# Altium project LibreSolar_BMS48V.PrjPcb
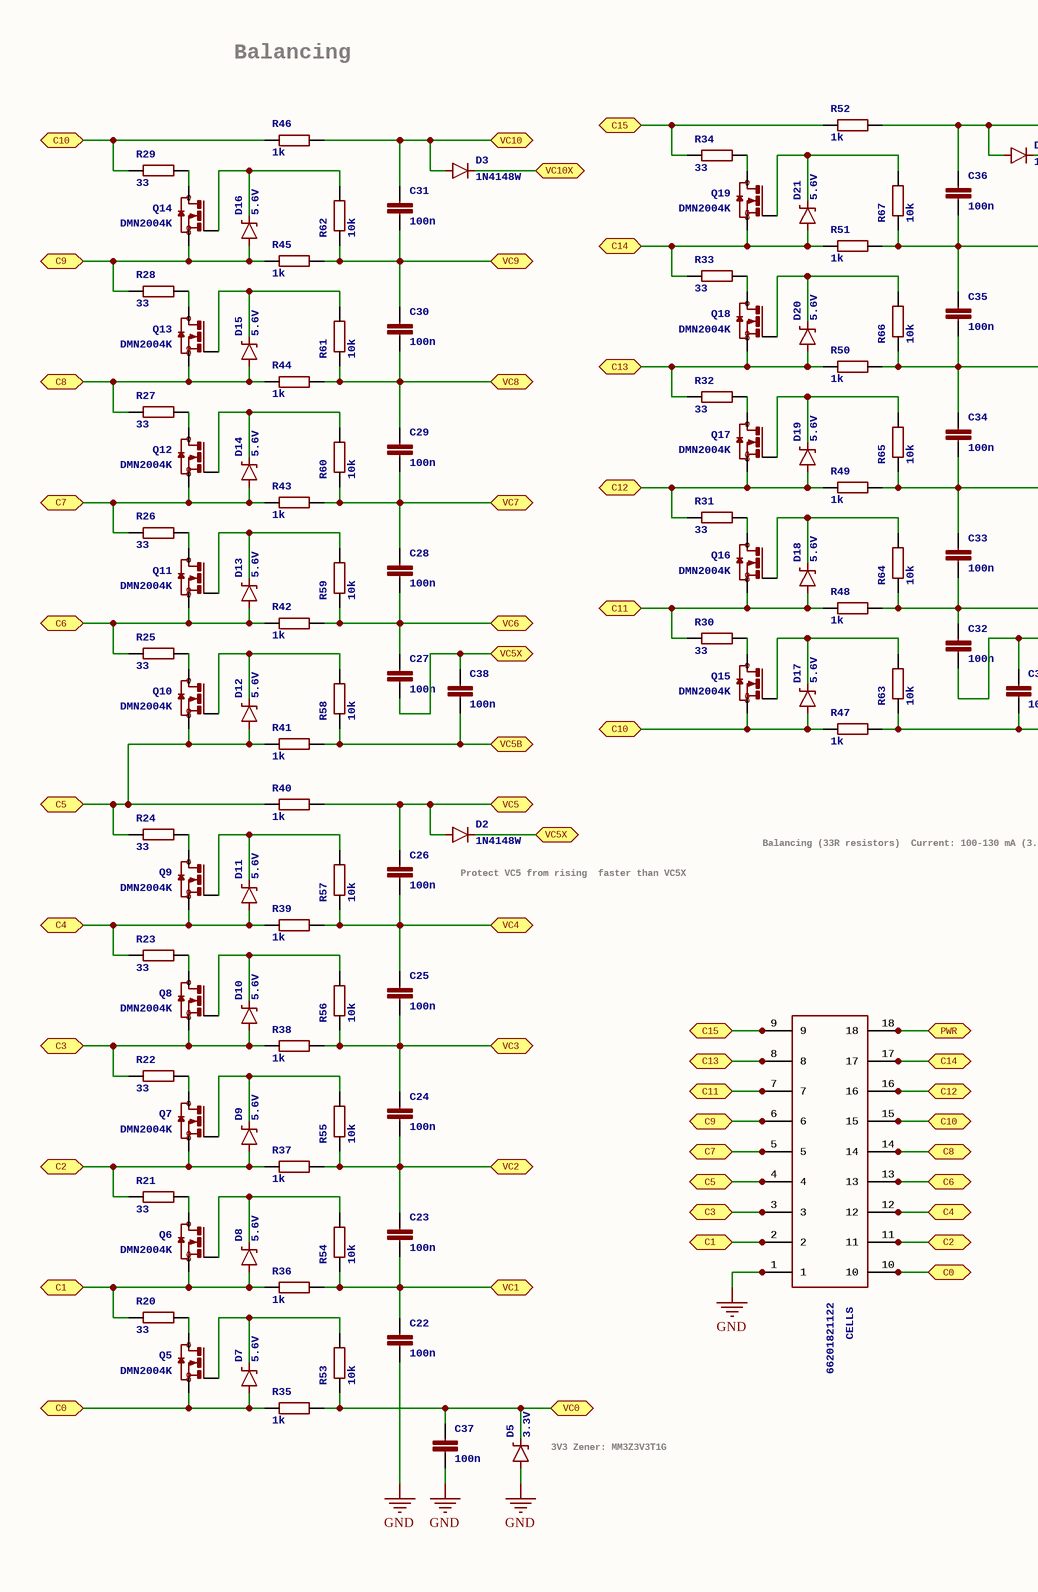
[diagram p0: LibreSolar_BMS48V_0.SchDoc, left]
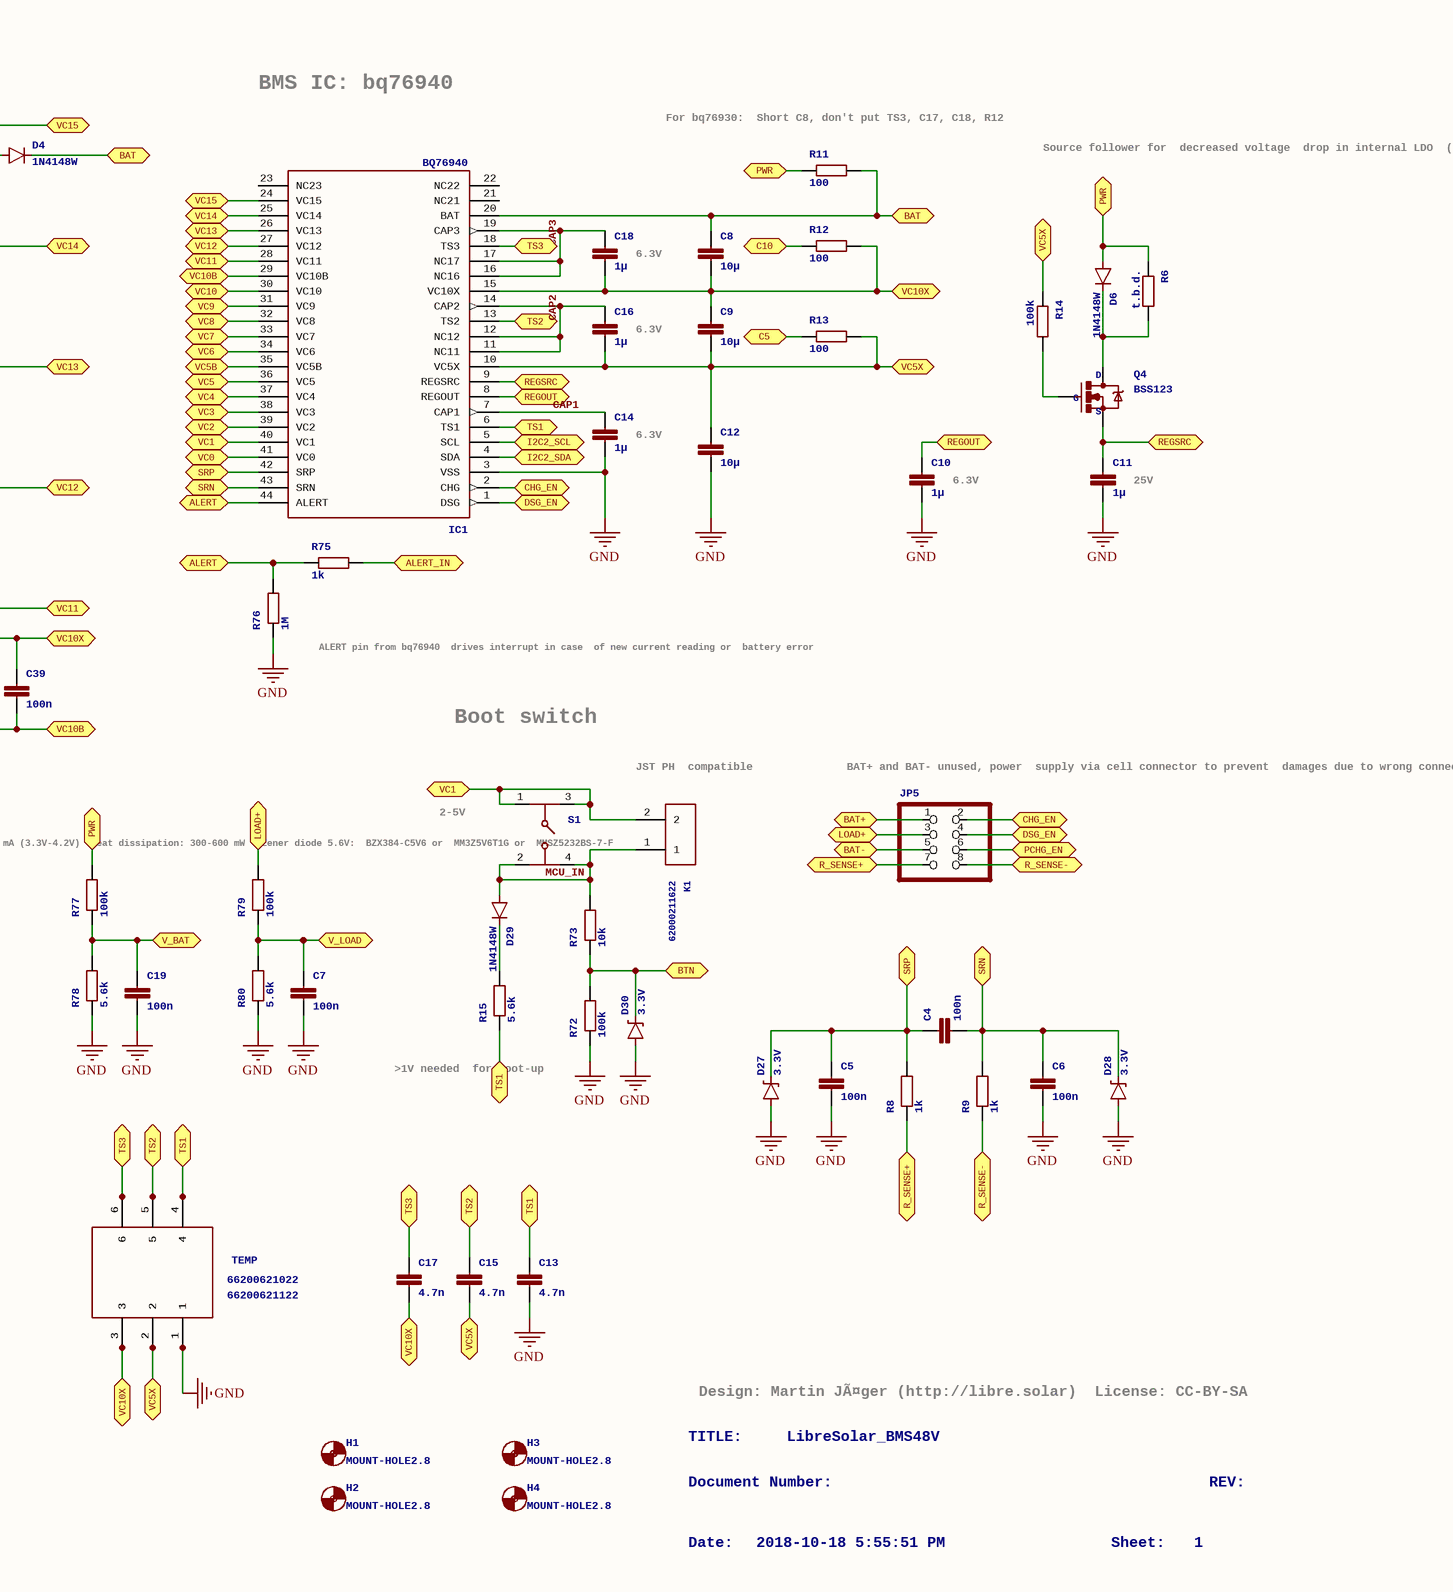
[diagram p1: LibreSolar_BMS48V_0.SchDoc, right]
2 sheets, 201 parts. Net scope: flat (ports and power ports of the same name join across sheets).
Board file: LibreSolar_BMS48V.PcbDoc
Sheets:
  LibreSolar_BMS48V_0.SchDoc
  LibreSolar_BMS48V_1.SchDoc

## Sheet LibreSolar_BMS48V_0.SchDoc: LibreSolar_BMS48V
size 410 x 286 mm; Date: 2018-10-18 5:55:51 PM; SheetNumber: 1; GateName_1: G$1; SymbolName_1: DINA3_L; LibraryName: frames; DeviceSetName: DINA3_L; GateName_2: G$2; SymbolName_2: DOCFIELD

### Parts
C4  100n  [C0603]
C5  100n  [C0603]
C6  100n  [C0603]
C7  100n  [C0603]
C8  10µ  [C1210]
C9  10µ  [C1210]
C10  1µ  [C0603]
C11  1µ  [C0603]
C12  10µ  [C1210]
C13  4.7n  [C0603]
C14  1µ  [C0603]
C15  4.7n  [C0603]
C16  1µ  [C0603]
C17  4.7n  [C0603]
C18  1µ  [C0603]
C19  100n  [C0603]
C22  100n  [C0603]
C23  100n  [C0603]
C24  100n  [C0603]
C25  100n  [C0603]
C26  100n  [C0603]
C27  100n  [C0603]
C28  100n  [C0603]
C29  100n  [C0603]
C30  100n  [C0603]
C31  100n  [C0603]
C32  100n  [C0603]
C33  100n  [C0603]
C34  100n  [C0603]
C35  100n  [C0603]
C36  100n  [C0603]
C37  100n  [C0603]
C38  100n  [C0603]
C39  100n  [C0603]
CELLS  66201821022  [66201821022]  (value not drawn)
D2  1N4148W  [SOD-123]
D3  1N4148W  [SOD-123]
D4  1N4148W  [SOD-123]
D5  3.3V  [SOD-323]
D6  1N4148W  [SOD-123]
D7  5.6V  [SOD-323]
D8  5.6V  [SOD-323]
D9  5.6V  [SOD-323]
D10  5.6V  [SOD-323]
D11  5.6V  [SOD-323]
D12  5.6V  [SOD-323]
D13  5.6V  [SOD-323]
D14  5.6V  [SOD-323]
D15  5.6V  [SOD-323]
D16  5.6V  [SOD-323]
D17  5.6V  [SOD-323]
D18  5.6V  [SOD-323]
D19  5.6V  [SOD-323]
D20  5.6V  [SOD-323]
D21  5.6V  [SOD-323]
D27  3.3V  [SOD-323]
D28  3.3V  [SOD-323]
D29  1N4148W  [SOD-123]
D30  3.3V  [SOD-323]
H1  MOUNT-HOLE2.8  [2,8]
H2  MOUNT-HOLE2.8  [2,8]
H3  MOUNT-HOLE2.8  [2,8]
H4  MOUNT-HOLE2.8  [2,8]
IC1  BQ76940  [TSSOP44]
JP5  PINHD-2X4  [2X04]  (value not drawn)
K1  62000211622  [62000211622]
K4  66200621122  [66200621122]
K5  66201821122  [66201821122]
Q4  BSS123  [SOT23-3]
Q5  DMN2004K  [SOT23]
Q6  DMN2004K  [SOT23]
Q7  DMN2004K  [SOT23]
Q8  DMN2004K  [SOT23]
Q9  DMN2004K  [SOT23]
Q10  DMN2004K  [SOT23]
Q11  DMN2004K  [SOT23]
Q12  DMN2004K  [SOT23]
Q13  DMN2004K  [SOT23]
Q14  DMN2004K  [SOT23]
Q15  DMN2004K  [SOT23]
Q16  DMN2004K  [SOT23]
Q17  DMN2004K  [SOT23]
Q18  DMN2004K  [SOT23]
Q19  DMN2004K  [SOT23]
R6  t.b.d.  [R0603]
R8  1k  [R0603]
R9  1k  [R0603]
R11  100  [R0603]
R12  100  [R0603]
R13  100  [R0603]
R14  100k  [R0603]
R15  5.6k  [R0603]
R20  33  [R2010]
R21  33  [R2010]
R22  33  [R2010]
R23  33  [R2010]
R24  33  [R2010]
R25  33  [R2010]
R26  33  [R2010]
R27  33  [R2010]
R28  33  [R2010]
R29  33  [R2010]
R30  33  [R2010]
R31  33  [R2010]
R32  33  [R2010]
R33  33  [R2010]
R34  33  [R2010]
R35  1k  [R0603]
R36  1k  [R0603]
R37  1k  [R0603]
R38  1k  [R0603]
R39  1k  [R0603]
R40  1k  [R0603]
R41  1k  [R0603]
R42  1k  [R0603]
R43  1k  [R0603]
R44  1k  [R0603]
R45  1k  [R0603]
R46  1k  [R0603]
R47  1k  [R0603]
R48  1k  [R0603]
R49  1k  [R0603]
R50  1k  [R0603]
R51  1k  [R0603]
R52  1k  [R0603]
R53  10k  [R0603]
R54  10k  [R0603]
R55  10k  [R0603]
R56  10k  [R0603]
R57  10k  [R0603]
R58  10k  [R0603]
R59  10k  [R0603]
R60  10k  [R0603]
R61  10k  [R0603]
R62  10k  [R0603]
R63  10k  [R0603]
R64  10k  [R0603]
R65  10k  [R0603]
R66  10k  [R0603]
R67  10k  [R0603]
R72  100k  [R0603]
R73  10k  [R0603]
R75  1k  [R0603]
R76  1M  [R0603]
R77  100k  [R0603]
R78  5.6k  [R0603]
R79  100k  [R0603]
R80  5.6k  [R0603]
S1  430182050816  [430182050816]  (value not drawn)
TEMP  66200621022  [66200621022]

### Ports
ALERT, ALERT_IN, BAT, BAT+, BAT-, BTN, C0, C1, C2, C3, C4, C5, C6, C7, C8, C9, C10, C11, C12, C13, C14, C15, CHG_EN, DSG_EN, I2C2_SCL, I2C2_SDA, LOAD+, PCHG_EN, PWR, R_SENSE+, R_SENSE-, REGOUT, REGSRC, SRN, SRP, TS1, TS2, TS3, V_BAT, V_LOAD, VC0, VC1, VC2, VC3, VC4, VC5, VC5B, VC5X, VC6, VC7, VC8, VC9, VC10, VC10B, VC10X, VC11, VC12, VC13, VC14, VC15

### Nets
GND: C5.2 C6.2 C7.2 C10.2 C11.2 C12.2 C13.2 C14.2 C19.2 C22.2 C37.2 CELLS.1 D5.A D27.A D28.A D30.A IC1.3(VSS) K4.1 K5.1 R72.1 R76.1 R78.1 R80.1 TEMP.1
CAP1: C14.1 IC1.7(CAP1)
CAP2: C16.1 IC1.11(NC11) IC1.12(NC12) IC1.14(CAP2)
CAP3: C18.1 IC1.16(NC16) IC1.17(NC17) IC1.19(CAP3)
MCU_IN: D29.A K1.1 R73.2 S1.2 S1.4
NetC3_1: CELLS.18 D6.A K5.18 R6.1 R11.1 R77.2 ; port PWR
NetC4_1: C4.1 C5.1 D27.C IC1.42(SRP) R8.2 ; port SRP
NetC4_2: C4.2 C6.1 D28.C IC1.43(SRN) R9.2 ; port SRN
NetC7_1: C7.1 R79.1 R80.2 ; port V_LOAD
NetC8_1: C8.1 D4.C IC1.20(BAT) R11.2 ; port BAT
NetC8_2: C8.2 C9.1 C17.2 C18.2 C32.2 C39.1 D3.C IC1.15(VC10X) K4.3 R12.2 TEMP.3 ; port VC10X
NetC9_2: C9.2 C12.1 C15.2 C16.2 C27.2 C38.1 D2.C IC1.10(VC5X) K4.2 R13.2 R14.1 TEMP.2 ; port VC5X
NetC10_1: C10.1 IC1.8(REGOUT) ; port REGOUT
NetC11_1: C11.1 IC1.9(REGSRC) Q4.2(S) ; port REGSRC
NetC13_1: C13.1 IC1.6(TS1) K4.4 R15.1 TEMP.4 ; port TS1
NetC15_1: C15.1 IC1.13(TS2) K4.5 TEMP.5 ; port TS2
NetC17_1: C17.1 IC1.18(TS3) K4.6 TEMP.6 ; port TS3
NetC19_1: C19.1 R77.1 R78.2 ; port V_BAT
NetC22_1: C22.1 C23.2 IC1.40(VC1) K1.2 R36.2 R54.1 S1.1 S1.3 ; port VC1
NetC23_1: C23.1 C24.2 IC1.39(VC2) R37.2 R55.1 ; port VC2
NetC24_1: C24.1 C25.2 IC1.38(VC3) R38.2 R56.1 ; port VC3
NetC25_1: C25.1 C26.2 IC1.37(VC4) R39.2 R57.1 ; port VC4
NetC26_1: C26.1 D2.A IC1.36(VC5) R40.2 ; port VC5
NetC27_1: C27.1 C28.2 IC1.34(VC6) R42.2 R59.1 ; port VC6
NetC28_1: C28.1 C29.2 IC1.33(VC7) R43.2 R60.1 ; port VC7
NetC29_1: C29.1 C30.2 IC1.32(VC8) R44.2 R61.1 ; port VC8
NetC30_1: C30.1 C31.2 IC1.31(VC9) R45.2 R62.1 ; port VC9
NetC31_1: C31.1 D3.A IC1.30(VC10) R46.2 ; port VC10
NetC32_1: C32.1 C33.2 IC1.28(VC11) R48.2 R64.1 ; port VC11
NetC33_1: C33.1 C34.2 IC1.27(VC12) R49.2 R65.1 ; port VC12
NetC34_1: C34.1 C35.2 IC1.26(VC13) R50.2 R66.1 ; port VC13
NetC35_1: C35.1 C36.2 IC1.25(VC14) R51.2 R67.1 ; port VC14
NetC36_1: C36.1 D4.A IC1.24(VC15) R52.2 ; port VC15
NetC37_1: C37.1 D5.C IC1.41(VC0) R35.2 R53.1 ; port VC0
NetC38_2: C38.2 IC1.35(VC5B) R41.2 R58.1 ; port VC5B
NetC39_2: C39.2 IC1.29(VC10B) R47.2 R63.1 ; port VC10B
NetCELLS_2: CELLS.2 D8.A K5.2 Q6.2(S) R20.1 R36.1 ; port C1
NetCELLS_3: CELLS.3 D10.A K5.3 Q8.2(S) R22.1 R38.1 ; port C3
NetCELLS_4: CELLS.4 D12.A K5.4 Q10.2(S) R13.1 R24.1 R40.1 R41.1 ; port C5
NetCELLS_5: CELLS.5 D14.A K5.5 Q12.2(S) R26.1 R43.1 ; port C7
NetCELLS_6: CELLS.6 D16.A K5.6 Q14.2(S) R28.1 R45.1 ; port C9
NetCELLS_7: CELLS.7 D18.A K5.7 Q16.2(S) R30.1 R48.1 ; port C11
NetCELLS_8: CELLS.8 D20.A K5.8 Q18.2(S) R32.1 R50.1 ; port C13
NetCELLS_9: CELLS.9 K5.9 R34.1 R52.1 ; port C15
NetCELLS_10: CELLS.10 D7.A K5.10 Q5.2(S) R35.1 ; port C0
NetCELLS_11: CELLS.11 D9.A K5.11 Q7.2(S) R21.1 R37.1 ; port C2
NetCELLS_12: CELLS.12 D11.A K5.12 Q9.2(S) R23.1 R39.1 ; port C4
NetCELLS_13: CELLS.13 D13.A K5.13 Q11.2(S) R25.1 R42.1 ; port C6
NetCELLS_14: CELLS.14 D15.A K5.14 Q13.2(S) R27.1 R44.1 ; port C8
NetCELLS_15: CELLS.15 D17.A K5.15 Q15.2(S) R12.1 R29.1 R46.1 R47.1 ; port C10
NetCELLS_16: CELLS.16 D19.A K5.16 Q17.2(S) R31.1 R49.1 ; port C12
NetCELLS_17: CELLS.17 D21.A K5.17 Q19.2(S) R33.1 R51.1 ; port C14
NetD6_C: D6.C Q4.3(D) R6.2
NetD7_C: D7.C Q5.1(G) R53.2
NetD8_C: D8.C Q6.1(G) R54.2
NetD9_C: D9.C Q7.1(G) R55.2
NetD10_C: D10.C Q8.1(G) R56.2
NetD11_C: D11.C Q9.1(G) R57.2
NetD12_C: D12.C Q10.1(G) R58.2
NetD13_C: D13.C Q11.1(G) R59.2
NetD14_C: D14.C Q12.1(G) R60.2
NetD15_C: D15.C Q13.1(G) R61.2
NetD16_C: D16.C Q14.1(G) R62.2
NetD17_C: D17.C Q15.1(G) R63.2
NetD18_C: D18.C Q16.1(G) R64.2
NetD19_C: D19.C Q17.1(G) R65.2
NetD20_C: D20.C Q18.1(G) R66.2
NetD21_C: D21.C Q19.1(G) R67.2
NetD29_C: D29.C R15.2
NetD30_C: D30.C R72.2 R73.1 ; port BTN
NetIC1_1: IC1.1(DSG) JP5.4 ; port DSG_EN
NetIC1_2: IC1.2(CHG) JP5.2 ; port CHG_EN
NetIC1_4: IC1.4(SDA) ; port I2C2_SDA
NetIC1_5: IC1.5(SCL) ; port I2C2_SCL
NetIC1_44: IC1.44(ALERT) R75.1 R76.2 ; port ALERT
NetJP5_1: JP5.1 ; port BAT+
NetJP5_3: JP5.3 R79.2 ; port LOAD+
NetJP5_5: JP5.5 ; port BAT-
NetJP5_6: JP5.6 ; port PCHG_EN
NetJP5_7: JP5.7 R8.1 ; port R_SENSE+
NetJP5_8: JP5.8 R9.1 ; port R_SENSE-
NetQ4_1: Q4.1(G) R14.2
NetQ5_3: Q5.3(D) R20.2
NetQ6_3: Q6.3(D) R21.2
NetQ7_3: Q7.3(D) R22.2
NetQ8_3: Q8.3(D) R23.2
NetQ9_3: Q9.3(D) R24.2
NetQ10_3: Q10.3(D) R25.2
NetQ11_3: Q11.3(D) R26.2
NetQ12_3: Q12.3(D) R27.2
NetQ13_3: Q13.3(D) R28.2
NetQ14_3: Q14.3(D) R29.2
NetQ15_3: Q15.3(D) R30.2
NetQ16_3: Q16.3(D) R31.2
NetQ17_3: Q17.3(D) R32.2
NetQ18_3: Q18.3(D) R33.2
NetQ19_3: Q19.3(D) R34.2
NetR75_2: R75.2 ; port ALERT_IN

Not connected (* = marked no-connect by the designer): IC1 21(NC21) 22(NC22) 23(NC23)

### Notes on the sheet
- Balancing
- BMS IC: bq76940
- (near R11) For bq76930:
  Short C8, don't put TS3, C17, C18, R12
- Source follower for
  decreased voltage
  drop in internal LDO
  (100V N-MOS)
- (near C18) 6.3V
- (near C16) 6.3V
- (near C14) 6.3V
- (near C10) 6.3V
- (near C11) 25V
- (near R76) ALERT pin from bq76940
  drives interrupt in case
  of new current reading or
  battery error
- Boot switch
- 2-5V
- (near K1) JST PH
  compatible
- (near JP5) BAT+ and BAT- unused, power
  supply via cell connector to prevent
  damages due to wrong connection order
- (near D2) Protect VC5 from rising
  faster than VC5X
- (near S1) Balancing (33R resistors)
  Current: 100-130 mA (3.3V-4.2V)
  Heat dissipation: 300-600 mW
  Zener diode 5.6V:
  BZX384-C5V6 or
  MM3Z5V6T1G or
  MMSZ5232BS-7-F
- >1V needed
  for boot-up
- Design: Martin JÃ¤ger (http://libre.solar)
  License: CC-BY-SA
- (near D5) 3V3 Zener: MM3Z3V3T1G
- TITLE:
- Document Number:
- LibreSolar_BMS48V
- REV:
- Date:
- 2018-10-18 5:55:51 PM
- Sheet:
- 1

### Library data of the parts
C4-C7 C13 C15 C17 C19 C22-C39 = C-EUC0603: CAPACITOR, European symbol; MPN: 0603B104K500CT; GateName_1: G$1; SymbolName_1: C-EU; MF: WALSIN; DeviceName: C0603; LibraryName: rcl; DeviceSetName: C-EU; OC_FARNELL: 2496834
C8 C9 C12 = C-EUC1210: CAPACITOR, European symbol; MPN: GRM32ER7YA106KA12L; GateName_1: G$1; SymbolName_1: C-EU; MF: MURATA; DeviceName: C1210; LibraryName: rcl; DeviceSetName: C-EU; OC_FARNELL: 1735537
C10 = C-EUC0603: CAPACITOR, European symbol; MPN: 0805YC475KAT2A; GateName_1: G$1; SymbolName_1: C-EU; MF: AVX; DeviceName: C0603; LibraryName: rcl; DeviceSetName: C-EU; OC_FARNELL: 1657937
C11 C14 C16 C18 = C-EUC0603: CAPACITOR, European symbol; MPN: GRM188R71E105KA12D; GateName_1: G$1; SymbolName_1: C-EU; MF: MURATA; DeviceName: C0603; LibraryName: rcl; DeviceSetName: C-EU; OC_FARNELL: 1735540
CELLS = 66201821022: WR-MPC3 3.00mm Male Dual Row Angled Header with Plastic Pegs, 18 Pins=>Code : Con_WTB-MPC3_2_PCB_THT66201821022  Details see: http://katalog.we-online.de/en/em/662_0xx_210_22Created 2014-06-06, Karrer Zheng2014 (C) WÃ¼rth Elektronik; GateName_1: G$1; SymbolName_1: 9X9; LibraryName: Wire_to_Board_Connectors_rev15d; DeviceSetName: 66201821022
D2-D4 D6 D29 = DIODESOD123: DiodeThese are standard reverse protection diodes and small signal diodes. SMA package can handle up to about 1A. SOD-323 can handle about 200mA. What the SOD-323 package when ordering, there are some mfgs out there that are 5-pin packages.; MPN: 1N4148W-7-F.; GateName_1: G$1; SymbolName_1: DIODE; DeviceName: SOD123; MF: DIODES INC.; LibraryName: SparkFun-DiscreteSemi; DeviceSetName: DIODE; OC_FARNELL: 1776392
D5 D27 D28 D30 = DIODE-ZENER5.6V: Zener Diode Production Part - 8199 3.4V Zener Voltage; MPN: BZX384-C5V6; GateName_1: G$1; DeviceName: 5.6V; MF: NXP; PROD_ID: DIO-12442; SymbolName_1: DIODE-ZENER; LibraryName: SparkFun-DiscreteSemi; DeviceSetName: DIODE-ZENER; OC_FARNELL: 8735743
D7-D21 = DIODE-ZENER5.6V: Zener Diode Production Part - 8199 3.4V Zener Voltage; MPN: BZX384-C5V6; GateName_1: G$1; MF: NXP; PROD_ID: DIO-12442; SymbolName_1: DIODE-ZENER; DeviceName: 5.6V; LibraryName: SparkFun-DiscreteSemi; DeviceSetName: DIODE-ZENER; OC_FARNELL: 8735743
H1-H4 = MOUNT-HOLE2.8: MOUNTING HOLE with drill center marker; GateName_1: G$1; DeviceName: 2.8; SymbolName_1: MOUNT-HOLE; LibraryName: holes; DeviceSetName: MOUNT-HOLE; MF: *; MPN: *; OC_FARNELL: unknown
IC1 = BQ76940: MPN: BQ7694003DBT; GateName_1: G$1; MF: TEXAS INSTRUMENTS; SymbolName_1: BQ76940; LibraryName: LibreSolar; DeviceSetName: BQ76940; OC_FARNELL: 2425791
JP5 = PINHD-2X4: PIN HEADER; GateName_1: A; SymbolName_1: PINH2X4; LibraryName: pinhead; DeviceSetName: PINHD-2X4
K1 = 62000211622: WR-WTB 2.00mm Male Vertical Shrouded Header, 2 Pins=>Code : Con_WTB_2.00_PCB_THT_62000211622  Details see: http://katalog.we-online.de/en/em/620_0xx_116_22Created 2014-06-05, Karrer Zheng2014 (C) WÃ¼rth Elektronik; GateName_1: G$1; SymbolName_1: 2; LibraryName: Wire_to_Board_Connectors_rev15d; DeviceSetName: 62000211622
K4 = 66200621122: WR-MPC3 3.00mm Male Dual Row Vertical Header, 6 Pins=>Code : Con_WTB_MPC3_2_PCB_THT_66200621122  Details see: http://katalog.we-online.de/en/em/662_0xx_211_22Created 2014-06-06, Karrer Zheng2014 (C) WÃ¼rth Elektronik; GateName_1: G$1; SymbolName_1: 3X3-1; LibraryName: Wire_to_Board_Connectors_rev15d; DeviceSetName: 66200621122
K5 = 66201821122: WR-MPC3 3.00mm Male Dual Row Vertical Header, 18 Pins=>Code : Con_WTB_MPC3_2_PCB_THT_66201821122  Details see: http://katalog.we-online.de/en/em/662_0xx_211_22Created 2014-06-06, Karrer Zheng2014 (C) WÃ¼rth Elektronik; GateName_1: G$1; SymbolName_1: 9X9; LibraryName: Wire_to_Board_Connectors_rev15d; DeviceSetName: 66201821122
Q4 = MOSFET-NCHANNELBSS138: Common NMOSFET PartsMFG P/NStore IDProd IDFDD8780TRANS-09984SI7820DNTRANS-11055FDS6630AIC-080892N7002PWTRANS-11151FQP30N06L  COM-10213TRANS-10060BSS123LT1GTRANS-08345BSS138TRANS-00830BS1702N7000; MPN: 2N7002,215; GateName_1: G$1; SymbolName_1: MOSFET-NCHANNEL-1; DeviceName: BSS138; MF: NXP; LibraryName: SparkFun-DiscreteSemi; DeviceSetName: MOSFET-NCHANNEL; OC_FARNELL: 1510761; PROD_ID: TRANS-00830; D: D; S: S; G: G
Q5-Q19 = DMN2004K: N-CHANNEL MOS FET with low VGS and ESD protection; MPN: DMN2004K-7; GateName_1: G$1; SymbolName_1: N-MOS; MF: DIODES INC.; LibraryName: resolut; DeviceSetName: DMN2004K; OC_FARNELL: 1713842
R6 R8 R9 R11-R13 R15 R35-R52 R72 R73 R75 R77-R80 = R-EU_R0603: RESISTOR, European symbol; MPN: MCMR06X1001FTL; GateName_1: G$1; SymbolName_1: R-EU; DeviceSetName: R-EU_; MF: MULTICOMP; DeviceName: R0603; LibraryName: rcl; OC_FARNELL: 2073348
R14 = R-EU_R0603: RESISTOR, European symbol; GateName_1: G$1; SymbolName_1: R-EU; DeviceSetName: R-EU_; DeviceName: R0603; LibraryName: rcl; MF: *; MPN: *; OC_FARNELL: unknown
R20-R34 = R-EU_R2010: RESISTOR, European symbol; MPN: ASC2010-33RFT4; GateName_1: G$1; SymbolName_1: R-EU; DeviceSetName: R-EU_; MF: WELWYN; DeviceName: R2010; LibraryName: rcl; OC_FARNELL: 2079038
R53-R67 = R-EU_R0603: RESISTOR, European symbol; MPN: ERJ3EKF1002V; GateName_1: G$1; SymbolName_1: R-EU; DeviceSetName: R-EU_; MF: PANASONIC ELECTRONIC COMPONENTS; DeviceName: R0603; LibraryName: rcl; OC_FARNELL: 2303192
R76 = R-EU_R0603: RESISTOR, European symbol; MPN: ERJU06F1004V; GateName_1: G$1; SymbolName_1: R-EU; DeviceSetName: R-EU_; MF: PANASONIC ELECTRONIC COMPONENTS; DeviceName: R0603; LibraryName: rcl; OC_FARNELL: 2145441
S1 = 430182050816: 6x6 mm SMD WS-TASV Details see: http://katalog.we-online.de/em/datasheet/4301x2xxx8x6.pdf2015 (C) WÃ¼rth Elektronik; GateName_1: G$1; SymbolName_1: TAV; LibraryName: EAGLE-TACT_SWITCHES-rev16e; DeviceSetName: 430182050816
TEMP = 66200621022: WR-MPC3 3.00mm Male Dual Row Angled Header with Plastic Pegs, 6 Pins=>Code : Con_WTB-MPC3_2_PCB_THT66200621022  Details see: http://katalog.we-online.de/en/em/662_0xx_210_22Created 2014-06-06, Karrer Zheng2014 (C) WÃ¼rth Elektronik; GateName_1: G$1; SymbolName_1: 3X3-1; LibraryName: Wire_to_Board_Connectors_rev15d; DeviceSetName: 66200621022

## Sheet LibreSolar_BMS48V_1.SchDoc: LibreSolar_BMS48V
size 410 x 286 mm; Date: 2018-10-18 5:55:55 PM; SheetNumber: 2; GateName_1: G$1; SymbolName_1: DINA3_L; LibraryName: frames; DeviceSetName: DINA3_L; GateName_2: G$2; SymbolName_2: DOCFIELD
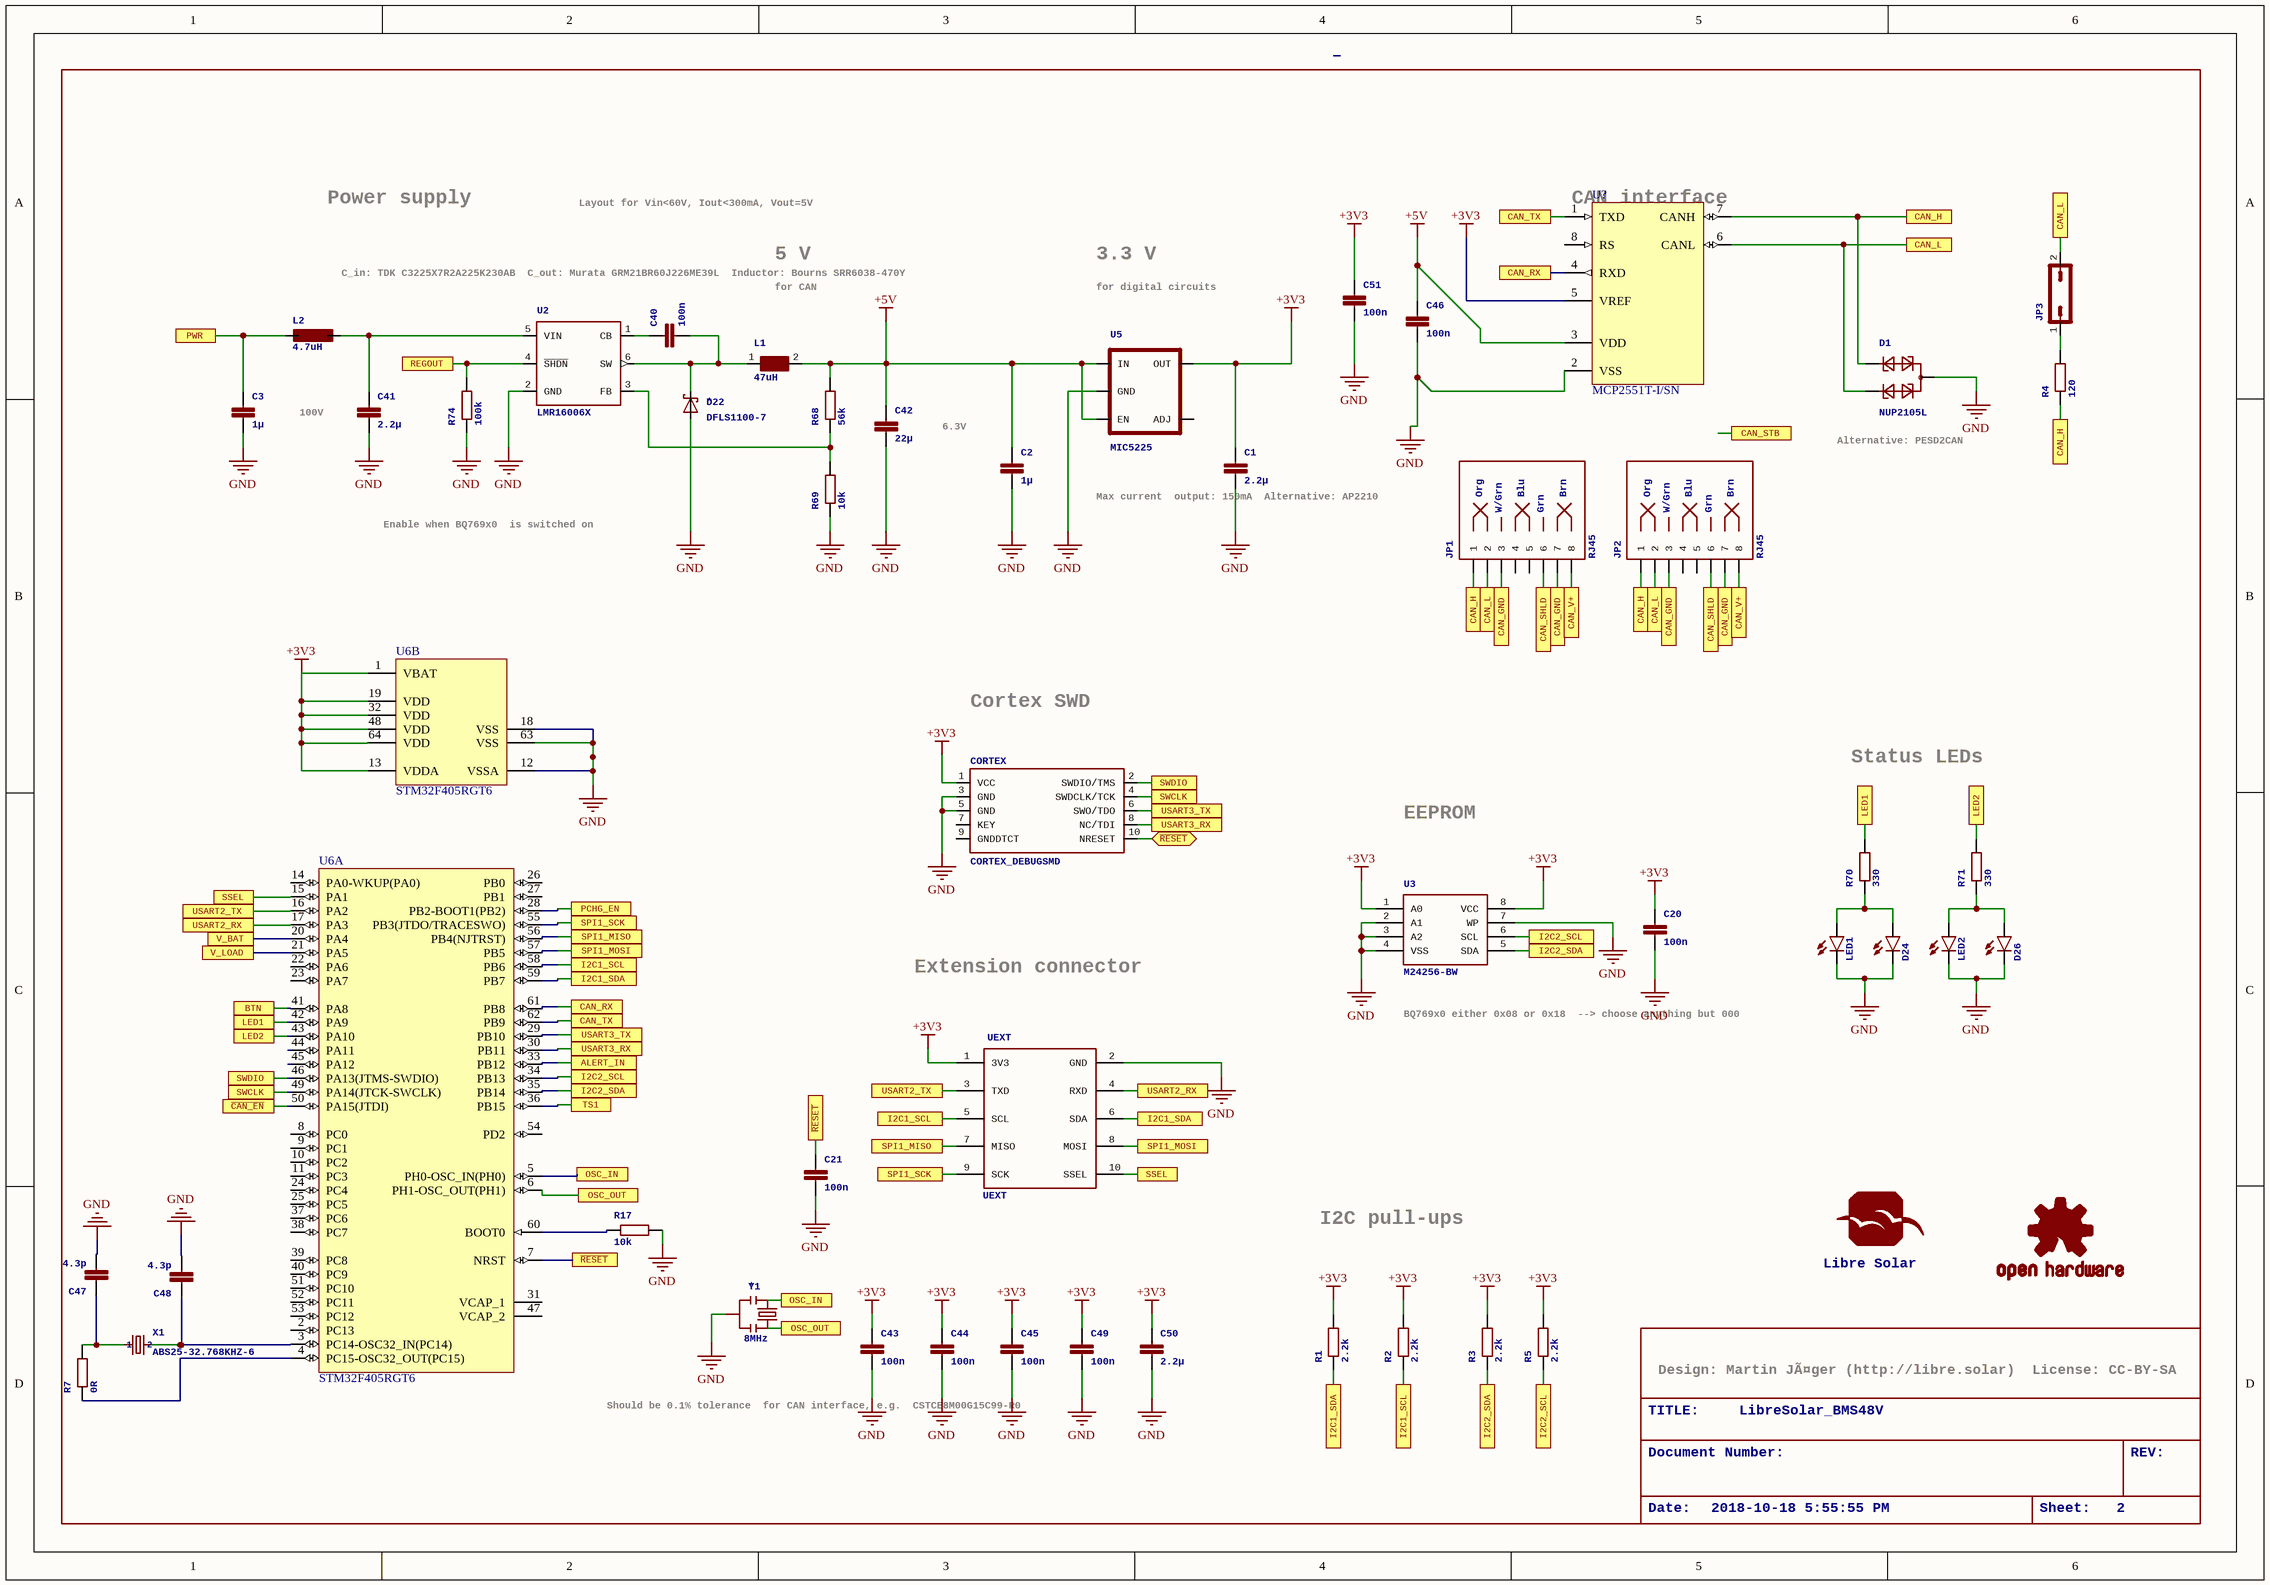
[diagram p2: LibreSolar_BMS48V_1.SchDoc]

### Parts
C1  2.2µ  [C0603]
C2  1µ  [C0603]
C3  1µ  [C0805]
C20  100n  [C0603]
C21  100n  [C0603]
C40  100n  [C0603]
C41  2.2µ  [C1210]
C42  22µ  [C0805]
C43  100n  [C0603]
C44  100n  [C0603]
C45  100n  [C0603]
C46  100n  [C0603]
C47  4.3p  [C0603]
C48  4.3p  [C0603]
C49  100n  [C0603]
C50  2.2µ  [C0603]
C51  100n  [C0603]
CORTEX  CORTEX_DEBUGSMD  [SAMTECH_FTSH-105-01]
D1  NUP2105L  [SOT23]
D22  DFLS1100-7  [POWERDI123]
D24  LED0603  [LED-0603]  (value not drawn)
D26  LED0603  [LED-0603]  (value not drawn)
JP1  RJ45  [RJ45-8]
JP2  RJ45  [RJ45-8]
JP3  JP1Q  [JP1]  (value not drawn)
L1  47uH  [WE-TPC_6823]
L2  4.7uH  [L2012C]
LED1  LED3MM  [LED3MM]  (value not drawn)
LED2  LED3MM  [LED3MM]  (value not drawn)
N1  OSHW-LOGOM  [OSHW-LOGO-M]  (value not drawn)
R1  2.2k  [R0603]
R2  2.2k  [R0603]
R3  2.2k  [R0603]
R4  120  [R1206]
R5  2.2k  [R0603]
R7  0R  [R0603]
R17  10k  [R0603]
R68  56k  [R0603]
R69  10k  [R0603]
R70  330  [R0603]
R71  330  [R0603]
R74  100k  [R0603]
U2  LMR16006X  [SOT23-6]
U3  M24256-BW  [SO08]
U5  MIC5225  [SOT23-5]
U6  STM32F405RGT6  [STM-LQFP64_N]  (parts A,B of 2)
U7  MCP2551T-I/SN  [SOIC-SN8_N]
U$1  LibreSolar: Libre Solar  [LIBRESOLAR_LOGO]  (hidden comment: LIBRESOLAR_LOGO)
UEXT  UEXT  [UEXT]
X1  ABS25-32.768KHZ-6  [MM20SS]
Y1  8MHz  [RESONATOR-SMD-1:1]

### Ports
ALERT_IN, BTN, CAN_GND, CAN_H, CAN_L, CAN_RX, CAN_SHLD, CAN_STB, CAN_TX, CAN_V+, I2C1_SCL, I2C1_SDA, I2C2_SCL, I2C2_SDA, LED1, LED2, OSC_IN, OSC_OUT, PCHG_EN, PWR, REGOUT, SPI1_MISO, SPI1_MOSI, SPI1_SCK, SSEL, SWCLK, SWDIO, TS1, USART2_RX, USART2_TX, USART3_RX, USART3_TX, V_BAT, V_LOAD, ~{CAN_EN}, ~{RESET}, ~{RESET} (bidir)

### Nets
+3V3: C1.1 C20.1 C43.1 C44.1 C45.1 C49.1 C50.1 C51.1 CORTEX.1(VCC) R1.2 R2.2 R3.2 R5.2 U3.1(A0) U3.8(VCC) U5.5(OUT) U6.1(VBAT) U6.13(VDDA) U6.19(VDD) U6.32(VDD) U6.48(VDD) U6.64(VDD) U7.5(VREF) UEXT.1(3V3)
+5V: C2.1 C42.1 C46.1 L1.2 R68.2 U5.1(IN) U5.3(EN) U7.3(VDD)
GND: C1.2 C2.2 C3.2 C20.2 C21.2 C41.2 C42.2 C43.2 C44.2 C45.2 C46.2 C47.2 C48.2 C49.2 C50.2 C51.2 CORTEX.3(GND) CORTEX.5(GND) D1.3 D22.A D24.C D26.C LED1.K(C) LED2.K(C) R17.2 R69.1 R74.1 U2.2(GND) U3.2(A1) U3.3(A2) U3.4(VSS) U3.7(WP) U5.2(GND) U6.12(VSSA) U6.18(VSS) U6.63(VSS) U7.2(VSS) UEXT.2(GND) Y1.2
NetC3_1: C3.1 L2.2 ; port PWR
NetC7_1: U6.21(PA5) ; port V_LOAD
NetC10_1: R74.2 U2.4(~{SHDN}) ; port REGOUT
NetC13_1: U6.36(PB15) ; port TS1
NetC19_1: U6.20(PA4) ; port V_BAT
NetC21_1: C21.1 CORTEX.10(NRESET) U6.7(NRST) ; port ~{RESET}
NetC40_1: C40.1 U2.1(CB)
NetC40_2: C40.2 D22.C L1.1 U2.6(SW)
NetC41_1: C41.1 L2.1 U2.5(VIN)
NetC47_1: C47.1 R7.2 X1.1
NetC48_1: C48.1 U6.3(PC14-OSC32_IN(PC14)) X1.4
NetCORTEX_2: CORTEX.2(SWDIO/TMS) U6.46(PA13(JTMS-SWDIO)) ; port SWDIO
NetCORTEX_4: CORTEX.4(SWDCLK/TCK) U6.49(PA14(JTCK-SWCLK)) ; port SWCLK
NetCORTEX_6: CORTEX.6(SWO/TDO) U6.29(PB10) ; port USART3_TX
NetCORTEX_8: CORTEX.8(NC/TDI) U6.30(PB11) ; port USART3_RX
NetD1_1: D1.1 JP1.1 JP2.1 R4.1 U7.7(CANH) ; port CAN_H
NetD1_2: D1.2 JP1.2 JP2.2 JP3.2 U7.6(CANL) ; port CAN_L
NetD24_A: D24.A LED1.A R70.1
NetD26_A: D26.A LED2.A R71.1
NetD30_C: U6.41(PA8) ; port BTN
NetIC1_4: R3.1 U3.5(SDA) U6.35(PB14) ; port I2C2_SDA
NetIC1_5: R5.1 U3.6(SCL) U6.34(PB13) ; port I2C2_SCL
NetJP1_3: JP1.3 JP1.7 JP2.3 JP2.7 ; port CAN_GND
NetJP1_6: JP1.6 JP2.6 ; port CAN_SHLD
NetJP1_8: JP1.8 JP2.8 ; port CAN_V+
NetJP3_1: JP3.1 R4.2
NetJP5_6: U6.28(PB2-BOOT1(PB2)) ; port PCHG_EN
NetR1_1: R1.1 U6.59(PB7) UEXT.6(SDA) ; port I2C1_SDA
NetR2_1: R2.1 U6.58(PB6) UEXT.5(SCL) ; port I2C1_SCL
NetR7_1: R7.1 U6.4(PC15-OSC32_OUT(PC15))
NetR17_1: R17.1 U6.60(BOOT0)
NetR68_1: R68.1 R69.2 U2.3(FB)
NetR70_2: R70.2 U6.42(PA9) ; port LED1
NetR71_2: R71.2 U6.43(PA10) ; port LED2
NetR75_2: U6.33(PB12) ; port ALERT_IN
NetU6_5: U6.5(PH0-OSC_IN(PH0)) Y1.1 ; port OSC_IN
NetU6_6: U6.6(PH1-OSC_OUT(PH1)) Y1.3 ; port OSC_OUT
NetU6_15: U6.15(PA1) UEXT.10(SSEL) ; port SSEL
NetU6_16: U6.16(PA2) UEXT.3(TXD) ; port USART2_TX
NetU6_17: U6.17(PA3) UEXT.4(RXD) ; port USART2_RX
NetU6_50: U6.50(PA15(JTDI)) ; port ~{CAN_EN}
NetU6_55: U6.55(PB3(JTDO/TRACESWO)) UEXT.9(SCK) ; port SPI1_SCK
NetU6_56: U6.56(PB4(NJTRST)) UEXT.7(MISO) ; port SPI1_MISO
NetU6_57: U6.57(PB5) UEXT.8(MOSI) ; port SPI1_MOSI
NetU6_61: U6.61(PB8) U7.4(RXD) ; port CAN_RX
NetU6_62: U6.62(PB9) U7.1(TXD) ; port CAN_TX

Not connected (* = marked no-connect by the designer): CORTEX 7(KEY) 9(GNDDTCT); JP1 4 5; JP2 4 5; U5 4(ADJ); U6 2(PC13) 8(PC0) 9(PC1) 10(PC2) 11(PC3) 14(PA0-WKUP(PA0)) 22(PA6) 23(PA7) 24(PC4) 25(PC5) 26(PB0) 27(PB1) 31(VCAP_1) 37(PC6) 38(PC7) 39(PC8) 40(PC9) 44(PA11) 45(PA12) 47(VCAP_2) 51(PC10) 52(PC11) 53(PC12) 54(PD2); U7 8(RS)

### Notes on the sheet
- Power supply
- Layout for Vin<60V, Iout<300mA, Vout=5V
- (near U7) CAN interface
- C_in: TDK C3225X7R2A225K230AB
  C_out: Murata GRM21BR60J226ME39L
  Inductor: Bourns SRR6038-470Y
- 5 V
- 3.3 V
- for CAN
- for digital circuits
- 100V
- 6.3V
- (near D1) Alternative: PESD2CAN
- Enable when BQ769x0
  is switched on
- (near C1) Max current
  output: 150mA
  Alternative: AP2210
- Cortex SWD
- Status LEDs
- EEPROM
- Extension connector
- BQ769x0 either 0x08 or 0x18
  --> choose anything but 000
- I2C pull-ups
- Design: Martin JÃ¤ger (http://libre.solar)
  License: CC-BY-SA
- Should be 0.1% tolerance
  for CAN interface, e.g.
  CSTCE8M00G15C99-R0
- TITLE:
- Document Number:
- LibreSolar_BMS48V
- REV:
- Date:
- 2018-10-18 5:55:55 PM
- Sheet:
- 2

### Library data of the parts
C1 C50 = C-EUC0603: as C10 on sheet LibreSolar_BMS48V_0; DeviceName: C0603; LibraryName: rcl; DeviceSetName: C-EU; OC_FARNELL: 1657937
C2 = C-EUC0603: CAPACITOR, European symbol; MPN: 08055C104KAT2A; GateName_1: G$1; SymbolName_1: C-EU; MF: AVX; DeviceName: C0603; LibraryName: rcl; DeviceSetName: C-EU; OC_FARNELL: 499687
C3 = C-EUC0805: CAPACITOR, European symbol; MPN: 08055C104KAT2A; GateName_1: G$1; SymbolName_1: C-EU; MF: AVX; DeviceName: C0805; LibraryName: rcl; DeviceSetName: C-EU; OC_FARNELL: 499687
C20 C21 C43-C45 C47-C49 = C-EUC0603: CAPACITOR, European symbol; MPN: GRM188R71H104KA93D; GateName_1: G$1; SymbolName_1: C-EU; MF: MURATA; DeviceName: C0603; LibraryName: rcl; DeviceSetName: C-EU; OC_FARNELL: 8820023
C40 = C-EUC0603: as C4 on sheet LibreSolar_BMS48V_0; DeviceName: C0603; LibraryName: rcl; DeviceSetName: C-EU; OC_FARNELL: 2496834
C41 = C-EUC1210: CAPACITOR, European symbol; MPN: C3225X7R2A225K230AB; GateName_1: G$1; SymbolName_1: C-EU; MF: TDK; DeviceName: C1210; LibraryName: rcl; DeviceSetName: C-EU; OC_FARNELL: 2112727
C42 = C-EUC0805: CAPACITOR, European symbol; MPN: GRM21BR60J226ME39L; GateName_1: G$1; SymbolName_1: C-EU; MF: MURATA; DeviceName: C0805; LibraryName: rcl; DeviceSetName: C-EU; OC_FARNELL: 1735531
C46 C51 = C-EUC0603: CAPACITOR, European symbol; MPN: 06035C104KAT2A; GateName_1: G$1; SymbolName_1: C-EU; MF: AVX; DeviceName: C0603; LibraryName: rcl; DeviceSetName: C-EU; OC_FARNELL: 1301804
CORTEX = CORTEX_DEBUGSMD: Cortex Debug ConnectorDatasheet; GateName_1: G$1; DeviceName: SMD; SymbolName_1: CORTEX_DEBUG; LibraryName: LibreSolar; DeviceSetName: CORTEX_DEBUG
D1 = PESD2CAN: CAN bus ESD protection diodeSource: http://www.nxp.com/documents/data_sheet/PESD1CAN.pdf; GateName_1: G$1; MF: NXP; SymbolName_1: PESD2CAN; LibraryName: LibreSolar; DeviceSetName: PESD2CAN; MPN: PESD2CAN; OC_FARNELL: 1510712
D22 = SCHOTTKY-DIODEPOWERDI123: Schottky Diode; GateName_1: G$1; MF: DIODES INC.; SymbolName_1: SCHOTTKY; DeviceName: POWERDI123; LibraryName: resolut; DeviceSetName: SCHOTTKY-DIODE; MPN: DFLS1100-7; NAME: *; OC_FARNELL: 1713889
D24 D26 = LED0603: LEDsStandard schematic elements and footprints for 5mm, 3mm, 1206, and 0603 sized LEDs. 5mm - Spark Fun Electronics SKU : COM-00529 (and others); GateName_1: G$1; SymbolName_1: LED; DeviceName: 0603; LibraryName: SparkFun-LED; DeviceSetName: LED; MF: *; MPN: *; OC_FARNELL: unknown
JP1 JP2 = RJ45-8PTH: RJ45 JackSimple RJ45, 8-pin connection - connector for common Cat5, Cat5e, and Cat6 Ethernet cables. Footprint not yet proven in production. Connector sku is PRT-00643; Breakout PCB sku is BOB-00716.; GateName_1: JP1; DeviceName: PTH; MF: AMPHENOL COMMERCIAL PRODUCTS; PROD_ID: CONN-08506; SymbolName_1: RJ45-8; LibraryName: SparkFun-Connectors; DeviceSetName: RJ45-8; MPN: RJHSE-5080; OC_FARNELL: 1860577; Org: Org; Blu: Blu; Brn: Brn; W/Grn: W/Grn; Grn: Grn
JP3 = JP1Q: JUMPER; GateName_1: A; SymbolName_1: J1; LibraryName: jumper; DeviceSetName: JP1Q
L1 = WE-TPC_6823: Shielded Tiny Power Inductor WE-TPC- Extremely flat power inductor- High current capability- High reliability and perfect soldering characteristics  because of integrated soldering pad- magnetically shielded-- Portable power like PDA, digital camera,    PCMICA-cards and displays-- DC/DC-converter-- Recommended for switching regulator IC's from    Linear Technology, National Semiconductor,    Texas Instruments and Fairchild Semiconductor  Details see: http://katalog.we-online.de/en/pbs/WE-TPC?Updated  by  Dan Xu 2014-07-112014 (C) WÃ¼rth Elektronik; GateName_1: G$1; SymbolName_1: -L; DeviceName: _6823; DeviceSetName: WE-TPC; LibraryName: PowerMagnetics
L2 = L-EUL2012C: INDUCTOR, European symbol; GateName_1: G$1; SymbolName_1: L-EU; DeviceName: L2012C; LibraryName: rcl; DeviceSetName: L-EU
LED1 LED2 = LED3MM: LEDsStandard schematic elements and footprints for 5mm, 3mm, 1206, and 0603 sized LEDs. 5mm - Spark Fun Electronics SKU : COM-00529 (and others); GateName_1: G$1; SymbolName_1: LED; DeviceName: 3MM; LibraryName: SparkFun-LED; DeviceSetName: LED; MF: *; MPN: *; OC_FARNELL: unknown
N1 = OSHW-LOGOM: Open Source Hardware Logo This logo indicates the piece of hardware it is found on incorporates a OSHW license and/or adheres to the definition of open source hardware found here: http://freedomdefined.org/OSHW; GateName_1: G$1; DeviceName: M; SymbolName_1: OSHW-LOGO; LibraryName: resolut; DeviceSetName: OSHW-LOGO; MF: *; MPN: *; OC_FARNELL: unknown
R1-R3 R5 = R-EU_R0603: RESISTOR, European symbol; MPN: RC0603FR-072K2L.; GateName_1: G$1; SymbolName_1: R-EU; DeviceSetName: R-EU_; MF: YAGEO (PHYCOMP); DeviceName: R0603; LibraryName: rcl; OC_FARNELL: 9238522
R4 = R-EU_R1206: RESISTOR, European symbol; MPN: WCR0805-120RFI; GateName_1: G$1; SymbolName_1: R-EU; DeviceSetName: R-EU_; MF: WELWYN; DeviceName: R1206; LibraryName: rcl; OC_FARNELL: 1100308
R7 R17 = R-EU_R0603: RESISTOR, European symbol; MPN: RC0603FR-0710KL; GateName_1: G$1; SymbolName_1: R-EU; DeviceSetName: R-EU_; MF: YAGEO (PHYCOMP); DeviceName: R0603; LibraryName: rcl; OC_FARNELL: 9238603
R68 = R-EU_R0603: RESISTOR, European symbol; MPN: CR0805-FX-1001ELF; GateName_1: G$1; SymbolName_1: R-EU; DeviceSetName: R-EU_; MF: BOURNS; DeviceName: R0603; LibraryName: rcl; OC_FARNELL: 2008380
R69 R74 = R-EU_R0603: as R53 on sheet LibreSolar_BMS48V_0; DeviceName: R0603; LibraryName: rcl; OC_FARNELL: 2303192
R70 R71 = R-EU_R0603: as R6 on sheet LibreSolar_BMS48V_0; DeviceName: R0603; LibraryName: rcl; OC_FARNELL: 2073348
U2 = LMR16006SOT-23: LMR16006 SIMPLE SWITCHERÂ® 60 V 0.6 A Buck Regulators With High Efficiency ECO Mode; MPN: LMR16006XDDCT; GateName_1: U1; DeviceName: SOT-23; MF: TEXAS INSTRUMENTS; SymbolName_1: LMR16006; LibraryName: resolut; DeviceSetName: LMR16006; OC_FARNELL: 2455133
U3 = EEPROM-I2CSMD: I2C EEPROM chips, 24LC256 (and others); GateName_1: G$1; DeviceName: SMD; SymbolName_1: EEPROM-I2C; LibraryName: SparkFun-DigitalIC; DeviceSetName: EEPROM-I2C
U5 = V_REG_MIC5235: MPN: MIC5225-3.3YM5-TR; GateName_1: G$1; SymbolName_1: V-REG-LDO-ADJ; MF: MICROCHIP; LibraryName: SparkFun-PowerIC; DeviceSetName: V_REG_MIC5235; OC_FARNELL: 2510262
U6 = STM32F405RGT6: ARM Cortex-M4 32-bit MCU+FPU, 210 DMIPS, 1024 kB Flash, 192 kB Internal RAM, 51 I/Os, 64-pin LQFP, -40 to 85 degC, Tray; Manufacturer: STMicroelectronics; D/A Converter: 2x12-bit; FLASH Size (Prog) (kB): 1024; I/Os (High Current): 51; Internal RAM Size (kB): 192; Operating Frequency(F) (Processor speed) (MHz): 168; Supply Voltage(Vcc) max (V): 3.6; Supply Voltage(Vcc) min (V): 1.8; DatasheetVersion: Rev. 4; PackageVersion: Rev. 4, 06/2013; PackageReference: LQFP64; PackageDescription: 64-Pin Low Profile Quad Flat Package, 10 x 10 mm Body, 0.5 mm Pitch; Supplier 1: Digi-Key; Supplier Part Number 1: 497-11767-ND; Supplier 2: Farnell; Supplier Part Number 2: 2064363; Supplier 3: Newark; Supplier Part Number 3: 73T2329; Supplier 4: Mouser; Supplier Part Number 4: 511-STM32F405RGT6; Core: ARM Cortex-M4; Packing: Tray; Mounting Technology: Surface Mount; PartNumber: STM32F405RGT6; ComponentLink1Description: Manufacturer URL; ComponentLink1URL: http://www.st.com/web/en/home.html; ComponentLink2Description: Datasheet; ComponentLink2URL: http://www.st.com/st-web-ui/static/active/en/resource/technical/document/datasheet/DM00037051.pdf; ComponentLink3Description: Package Specification; ComponentLink3URL: http://www.st.com/st-web-ui/static/active/en/resource/technical/document/datasheet/DM00037051.pdf
U7 = MCP2551T-I/SN: High-Speed CAN Transceiver, 8-Pin SOIC, Industrial Temperature, Tape and Reel; Manufacturer: Microchip
U$1 = LIBRESOLAR_LOGO: GateName_1: G$1; SymbolName_1: LIBRESOLAR_LOGO; LibraryName: LibreSolar; DeviceSetName: LIBRESOLAR_LOGO
UEXT = UEXT: WR-BHD 2.54mm Male Box Header, 10 Pins=>Code : Con_WTB_BHD_2.54_Male_THT_WS_61201021621  Details see: http://katalog.we-online.de/en/em/612_0xx_216_21Created 2014-06-04, Karrer Zheng2014 (C) WÃ¼rth Elektronik; GateName_1: G$1; SymbolName_1: UEXT; LibraryName: LibreSolar; DeviceSetName: UEXT
X1 = CRYSTALMM20SS: CRYSTAL; GateName_1: G$1; SymbolName_1: Q; DeviceName: MM20SS; LibraryName: crystal; DeviceSetName: CRYSTAL; MF: *; MPN: *; OC_FARNELL: unknown; OC_NEWARK: unknown; 1: 1; 2: 2
Y1 = RESONATOR1:1: ResonatorSmall SMD resonator. This is the itty bitty 10/20MHz resonators with built in caps. CSTCE10M0G55 and CSTCE20M0V53. Footprint for SMD has been used in SFE production for years, and does work okay. 1:1 is an attempt to get larger fillets on the sides so it will be easier to inspect these solders in our AOI machine. The pads have been minimized to match the actual metal under the resonator. To see this relation, it includes an image import of the bottom side of the component. Imported to scale on layer 200.; MPN: CSTCE8M00G15C99-R0; GateName_1: G$1; MF: MURATA; SymbolName_1: RESONATOR; DeviceName: 1:1; LibraryName: Testing; DeviceSetName: RESONATOR; NAME: *

## Nets that join several sheets
GND: LibreSolar_BMS48V_0 (24 pins), LibreSolar_BMS48V_1 (39 pins)
NetC3_1: LibreSolar_BMS48V_0 (6 pins), LibreSolar_BMS48V_1 (C3.1 L2.2)
NetC7_1: LibreSolar_BMS48V_0 (C7.1 R79.1 R80.2), LibreSolar_BMS48V_1 (U6.21)
NetC10_1: LibreSolar_BMS48V_0 (C10.1 IC1.8), LibreSolar_BMS48V_1 (R74.2 U2.4)
NetC13_1: LibreSolar_BMS48V_0 (5 pins), LibreSolar_BMS48V_1 (U6.36)
NetC19_1: LibreSolar_BMS48V_0 (C19.1 R77.1 R78.2), LibreSolar_BMS48V_1 (U6.20)
NetD30_C: LibreSolar_BMS48V_0 (D30.C R72.2 R73.1), LibreSolar_BMS48V_1 (U6.41)
NetIC1_4: LibreSolar_BMS48V_0 (IC1.4), LibreSolar_BMS48V_1 (R3.1 U3.5 U6.35)
NetIC1_5: LibreSolar_BMS48V_0 (IC1.5), LibreSolar_BMS48V_1 (R5.1 U3.6 U6.34)
NetJP5_6: LibreSolar_BMS48V_0 (JP5.6), LibreSolar_BMS48V_1 (U6.28)
NetR75_2: LibreSolar_BMS48V_0 (R75.2), LibreSolar_BMS48V_1 (U6.33)